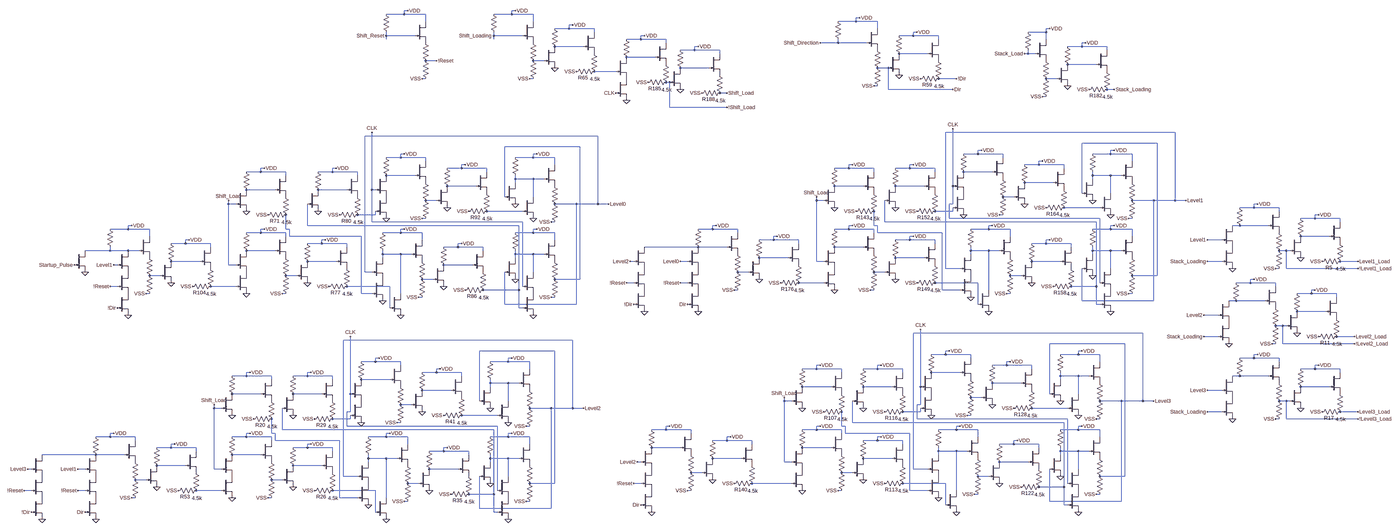
[diagram p0: schematic Controls.asc, whole sheet]
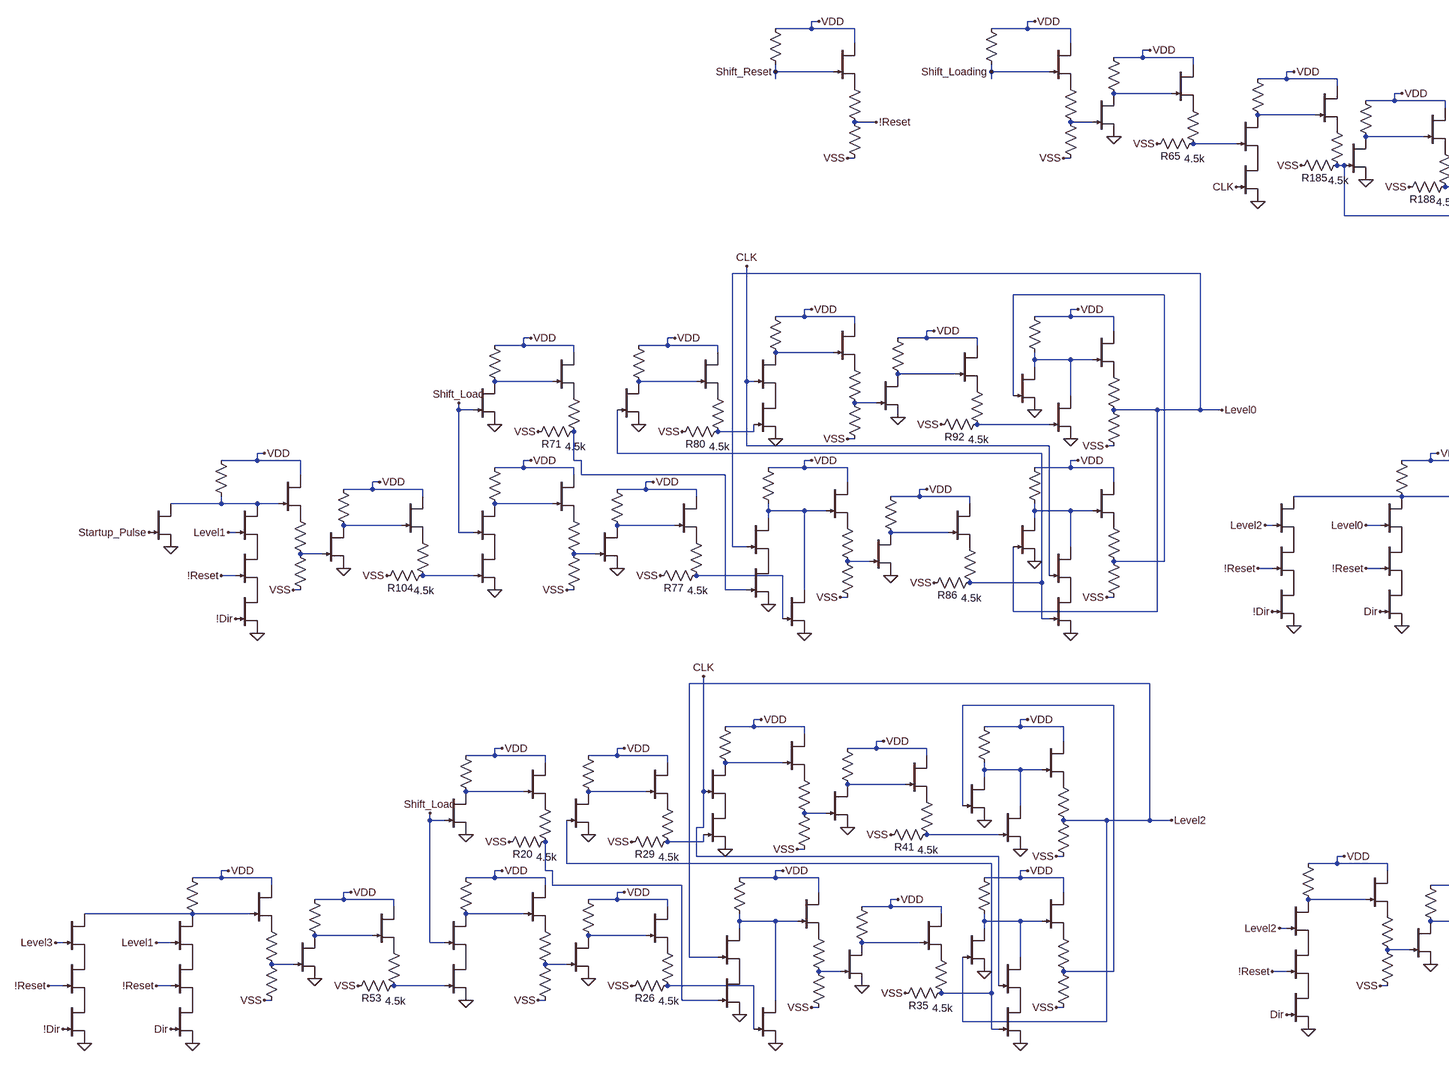
[diagram p1: schematic Controls.asc, part, row 1 of 1, column 1 of 2]
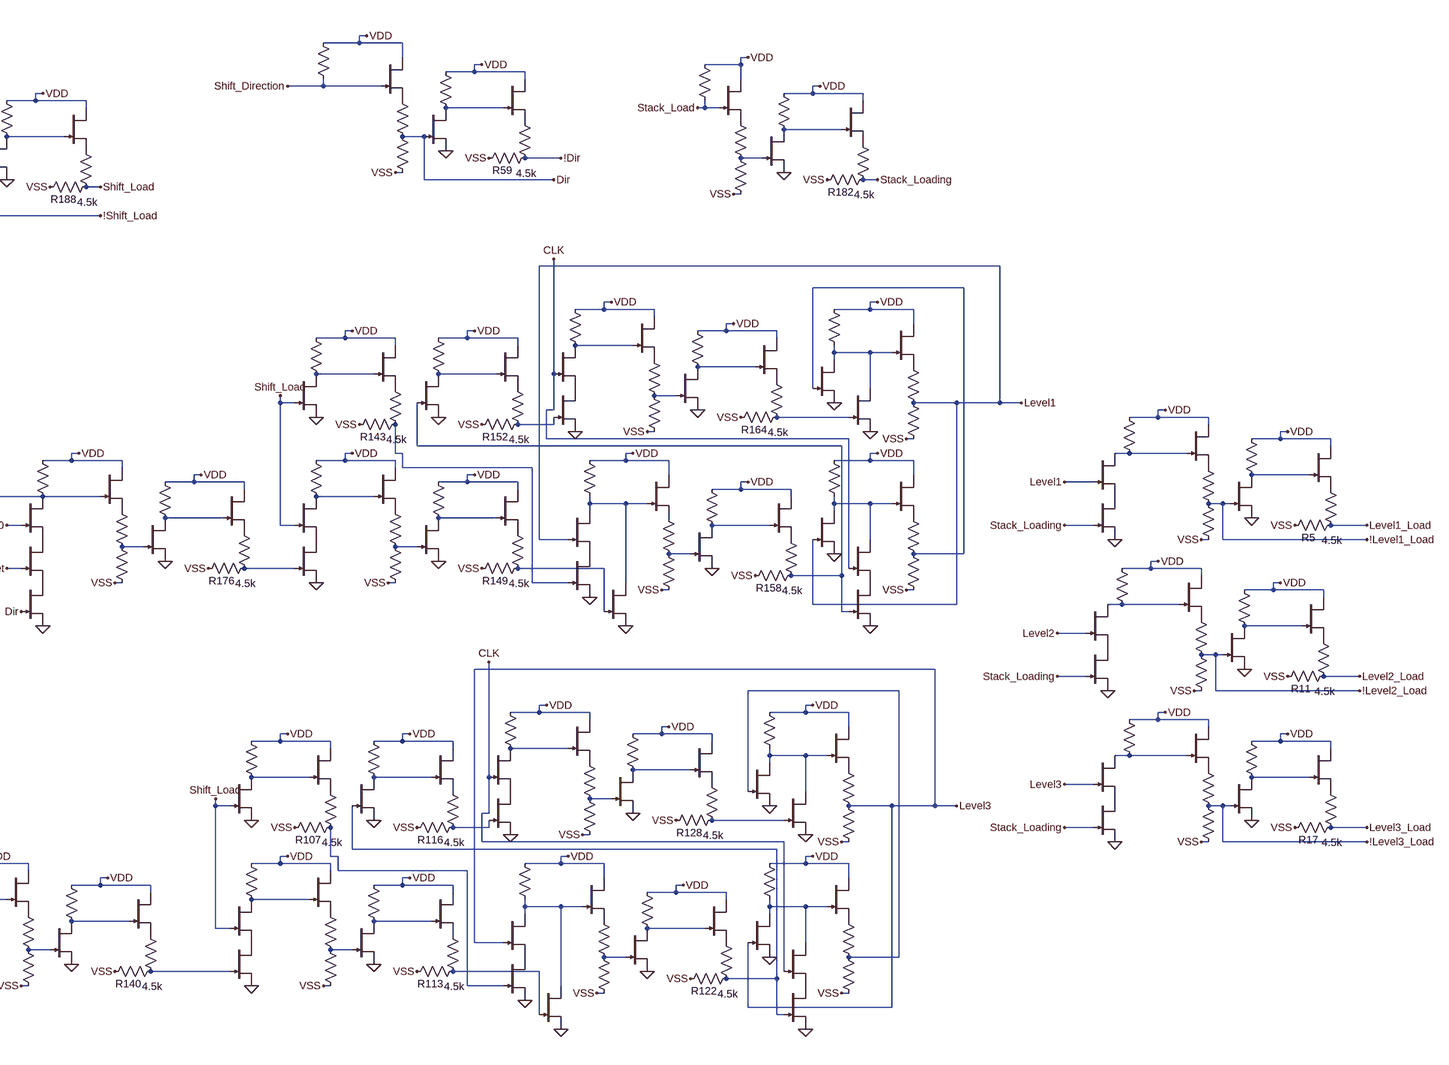
[diagram p2: schematic Controls.asc, part, row 1 of 1, column 2 of 2]
* Controls.asc
J0 N030 Level1 P001 DR
R0 VDD N030 100k
J1 VDD N030 P002 DR
R1 P002 !Level1_Load 1k
R2 !Level1_Load VSS 4.8k
J2 P001 Stack_Loading 0 DR
J3 N032 !Level1_Load 0 DR
R3 VDD N032 50k
J4 VDD N032 P003 DR
R4 P003 Level1_Load 1k
R5 Level1_Load VSS 4.5k
J5 N057 Level2 P004 DR
R6 VDD N057 100k
J6 VDD N057 P005 DR
R7 P005 !Level2_Load 1k
R8 !Level2_Load VSS 4.8k
J7 P004 Stack_Loading 0 DR
J8 N058 !Level2_Load 0 DR
R9 VDD N058 50k
J9 VDD N058 P006 DR
R10 P006 Level2_Load 1k
R11 Level2_Load VSS 4.5k
J10 N063 Level3 P007 DR
R12 VDD N063 100k
J11 VDD N063 P008 DR
R13 P008 !Level3_Load 1k
R14 !Level3_Load VSS 4.8k
J12 P007 Stack_Loading 0 DR
J13 N069 !Level3_Load 0 DR
R15 VDD N069 50k
J14 VDD N069 P009 DR
R16 P009 Level3_Load 1k
R17 Level3_Load VSS 4.5k
J15 N071 Shift_Load 0 DR
R18 VDD N071 50k
J16 VDD N071 P010 DR
R19 P010 N082 1k
R20 N082 VSS 4.5k
J17 N088 Shift_Load P011 DR
R21 VDD N088 100k
J18 VDD N088 P012 DR
R22 P012 N101 1k
R23 N101 VSS 4.8k
J19 P011 N105 0 DR
J20 N095 N101 0 DR
R24 VDD N095 50k
J21 VDD N095 P013 DR
R25 P013 N106 1k
R26 N106 VSS 4.5k
J22 N072 N081 0 DR
R27 VDD N072 50k
J23 VDD N072 P014 DR
R28 P014 N078 1k
R29 N078 VSS 4.5k
J24 P015 N082 0 DR
R30 VDD N089 100k
J25 VDD N089 P016 DR
R31 P016 N102 1k
R32 N102 VSS 4.8k
J26 N089 N106 0 DR
J27 N096 N102 0 DR
R33 VDD N096 50k
J28 VDD N096 P017 DR
R34 P017 N081 1k
R35 N081 VSS 4.5k
J29 N064 CLK P018 DR
R36 VDD N064 100k
J30 VDD N064 P019 DR
R37 P019 N074 1k
R38 N074 VSS 4.8k
J31 P018 N078 0 DR
J32 N070 N074 0 DR
R39 VDD N070 50k
J33 VDD N070 P020 DR
R40 P020 N077 1k
R41 N077 VSS 4.5k
J34 N065 N060 0 DR
R42 VDD N065 100k
J35 VDD N065 P021 DR
R43 P021 Level2 1k
R44 Level2 VSS 4.8k
J36 N065 N077 0 DR
J37 N090 Level2 0 DR
R45 VDD N090 100k
J38 VDD N090 P022 DR
R46 P022 N060 1k
R47 N060 VSS 4.8k
J39 N090 CLK P023 DR
J40 N087 Level1 P024 DR
R48 VDD N087 100k
J41 VDD N087 P025 DR
R49 P025 N100 1k
R50 N100 VSS 4.8k
J42 P024 !Reset P026 DR
J43 N094 N100 0 DR
R51 VDD N094 50k
J44 VDD N094 P027 DR
R52 P027 N105 1k
R53 N105 VSS 4.5k
J45 N087 Level3 P028 DR
J46 P028 !Reset P029 DR
J47 P029 !Dir 0 DR
J48 P026 Dir 0 DR
R54 VDD Shift_Direction 100k
J49 VDD Shift_Direction P030 DR
R55 P030 Dir 1k
R56 Dir VSS 4.8k
J50 N002 Dir 0 DR
R57 VDD N002 50k
J51 VDD N002 P031 DR
R58 P031 !Dir 1k
R59 !Dir VSS 4.5k
R60 VDD Shift_Loading 100k
J52 VDD Shift_Loading P032 DR
R61 P032 N004 1k
R62 N004 VSS 4.8k
J53 N001 N004 0 DR
R63 VDD N001 50k
J54 VDD N001 P033 DR
R64 P033 N007 1k
R65 N007 VSS 4.5k
R66 VDD Shift_Reset 100k
J55 VDD Shift_Reset P034 DR
R67 P034 !Reset 1k
R68 !Reset VSS 4.8k
J56 N089 Level2 P015 DR
J57 P023 N081 0 DR
J58 N019 Shift_Load 0 DR
R69 VDD N019 50k
J59 VDD N019 P035 DR
R70 P035 N031 1k
R71 N031 VSS 4.5k
J60 N036 Shift_Load P036 DR
R72 VDD N036 100k
J61 VDD N036 P037 DR
R73 P037 N050 1k
R74 N050 VSS 4.8k
J62 P036 N055 0 DR
J63 N044 N050 0 DR
R75 VDD N044 50k
J64 VDD N044 P038 DR
R76 P038 N056 1k
R77 N056 VSS 4.5k
J65 N020 N028 0 DR
R78 VDD N020 50k
J66 VDD N020 P039 DR
R79 P039 N026 1k
R80 N026 VSS 4.5k
J67 P040 N031 0 DR
R81 VDD N039 100k
J68 VDD N039 P041 DR
R82 P041 N052 1k
R83 N052 VSS 4.8k
J69 N039 N056 0 DR
J70 N046 N052 0 DR
R84 VDD N046 50k
J71 VDD N046 P042 DR
R85 P042 N028 1k
R86 N028 VSS 4.5k
J72 N012 CLK P043 DR
R87 VDD N012 100k
J73 VDD N012 P044 DR
R88 P044 N022 1k
R89 N022 VSS 4.8k
J74 P043 N026 0 DR
J75 N016 N022 0 DR
R90 VDD N016 50k
J76 VDD N016 P045 DR
R91 P045 N024 1k
R92 N024 VSS 4.5k
J77 N014 N010 0 DR
R93 VDD N014 100k
J78 VDD N014 P046 DR
R94 P046 Level0 1k
R95 Level0 VSS 4.8k
J79 N014 N024 0 DR
J80 N040 Level0 0 DR
R96 VDD N040 100k
J81 VDD N040 P047 DR
R97 P047 N010 1k
R98 N010 VSS 4.8k
J82 N040 CLK P048 DR
J83 N039 Level0 P040 DR
J84 P048 N028 0 DR
R99 VDD N035 100k
J85 VDD N035 P049 DR
R100 P049 N049 1k
R101 N049 VSS 4.8k
J86 N035 Startup_Pulse 0 DR
J87 N043 N049 0 DR
R102 VDD N043 50k
J88 VDD N043 P050 DR
R103 P050 N055 1k
R104 N055 VSS 4.5k
J89 N035 Level1 P051 DR
J90 P051 !Reset P052 DR
J91 P052 !Dir 0 DR
J92 N067 Shift_Load 0 DR
R105 VDD N067 50k
J93 VDD N067 P053 DR
R106 P053 N080 1k
R107 N080 VSS 4.5k
J94 N084 Shift_Load P054 DR
R108 VDD N084 100k
J95 VDD N084 P055 DR
R109 P055 N098 1k
R110 N098 VSS 4.8k
J96 P054 N103 0 DR
J97 N092 N098 0 DR
R111 VDD N092 50k
J98 VDD N092 P056 DR
R112 P056 N104 1k
R113 N104 VSS 4.5k
J99 N068 N079 0 DR
R114 VDD N068 50k
J100 VDD N068 P057 DR
R115 P057 N076 1k
R116 N076 VSS 4.5k
J101 P058 N080 0 DR
R117 VDD N085 100k
J102 VDD N085 P059 DR
R118 P059 N099 1k
R119 N099 VSS 4.8k
J103 N085 N104 0 DR
J104 N093 N099 0 DR
R120 VDD N093 50k
J105 VDD N093 P060 DR
R121 P060 N079 1k
R122 N079 VSS 4.5k
J106 N061 CLK P061 DR
R123 VDD N061 100k
J107 VDD N061 P062 DR
R124 P062 N073 1k
R125 N073 VSS 4.8k
J108 P061 N076 0 DR
J109 N066 N073 0 DR
R126 VDD N066 50k
J110 VDD N066 P063 DR
R127 P063 N075 1k
R128 N075 VSS 4.5k
J111 N062 N059 0 DR
R129 VDD N062 100k
J112 VDD N062 P064 DR
R130 P064 Level3 1k
R131 Level3 VSS 4.8k
J113 N062 N075 0 DR
J114 N086 Level3 0 DR
R132 VDD N086 100k
J115 VDD N086 P065 DR
R133 P065 N059 1k
R134 N059 VSS 4.8k
J116 N086 CLK P066 DR
J117 N085 Level3 P058 DR
J118 P066 N079 0 DR
J119 N083 Level2 P067 DR
R135 VDD N083 100k
J120 VDD N083 P068 DR
R136 P068 N097 1k
R137 N097 VSS 4.8k
J121 P067 !Reset P069 DR
J122 N091 N097 0 DR
R138 VDD N091 50k
J123 VDD N091 P070 DR
R139 P070 N103 1k
R140 N103 VSS 4.5k
J124 P069 Dir 0 DR
J125 N017 Shift_Load 0 DR
R141 VDD N017 50k
J126 VDD N017 P071 DR
R142 P071 N029 1k
R143 N029 VSS 4.5k
J127 N034 Shift_Load P072 DR
R144 VDD N034 100k
J128 VDD N034 P073 DR
R145 P073 N048 1k
R146 N048 VSS 4.8k
J129 P072 N053 0 DR
J130 N042 N048 0 DR
R147 VDD N042 50k
J131 VDD N042 P074 DR
R148 P074 N054 1k
R149 N054 VSS 4.5k
J132 N018 N027 0 DR
R150 VDD N018 50k
J133 VDD N018 P075 DR
R151 P075 N025 1k
R152 N025 VSS 4.5k
J134 P076 N029 0 DR
R153 VDD N037 100k
J135 VDD N037 P077 DR
R154 P077 N051 1k
R155 N051 VSS 4.8k
J136 N037 N054 0 DR
J137 N045 N051 0 DR
R156 VDD N045 50k
J138 VDD N045 P078 DR
R157 P078 N027 1k
R158 N027 VSS 4.5k
J139 N011 CLK P079 DR
R159 VDD N011 100k
J140 VDD N011 P080 DR
R160 P080 N021 1k
R161 N021 VSS 4.8k
J141 P079 N025 0 DR
J142 N015 N021 0 DR
R162 VDD N015 50k
J143 VDD N015 P081 DR
R163 P081 N023 1k
R164 N023 VSS 4.5k
J144 N013 N009 0 DR
R165 VDD N013 100k
J145 VDD N013 P082 DR
R166 P082 Level1 1k
R167 Level1 VSS 4.8k
J146 N013 N023 0 DR
J147 N038 Level1 0 DR
R168 VDD N038 100k
J148 VDD N038 P083 DR
R169 P083 N009 1k
R170 N009 VSS 4.8k
J149 N038 CLK P084 DR
J150 N033 Level0 P085 DR
R171 VDD N033 100k
J151 VDD N033 P086 DR
R172 P086 N047 1k
R173 N047 VSS 4.8k
J152 P085 !Reset P087 DR
J153 N041 N047 0 DR
R174 VDD N041 50k
J154 VDD N041 P088 DR
R175 P088 N053 1k
R176 N053 VSS 4.5k
J155 N033 Level2 P089 DR
J156 P089 !Reset P090 DR
J157 P090 !Dir 0 DR
J158 P087 Dir 0 DR
J159 N037 Level1 P076 DR
J160 P084 N027 0 DR
R177 VDD Stack_Load 100k
J161 VDD Stack_Load P091 DR
R178 P091 N008 1k
R179 N008 VSS 4.8k
J162 N005 N008 0 DR
R180 VDD N005 50k
J163 VDD N005 P092 DR
R181 P092 Stack_Loading 1k
R182 Stack_Loading VSS 4.5k
J164 N003 N007 P093 DR
R183 VDD N003 50k
J165 VDD N003 P094 DR
R184 P094 !Shift_Load 1k
R185 !Shift_Load VSS 4.5k
J166 N006 !Shift_Load 0 DR
R186 VDD N006 50k
J167 VDD N006 P095 DR
R187 P095 Shift_Load 1k
R188 Shift_Load VSS 4.5k
J168 P093 CLK 0 DR
.model NJF NJF
.model PJF PJF
.lib standard.jft
.backanno
.end